# Altium schematic sheet 840P..08.schdoc
size 177 x 100 mm
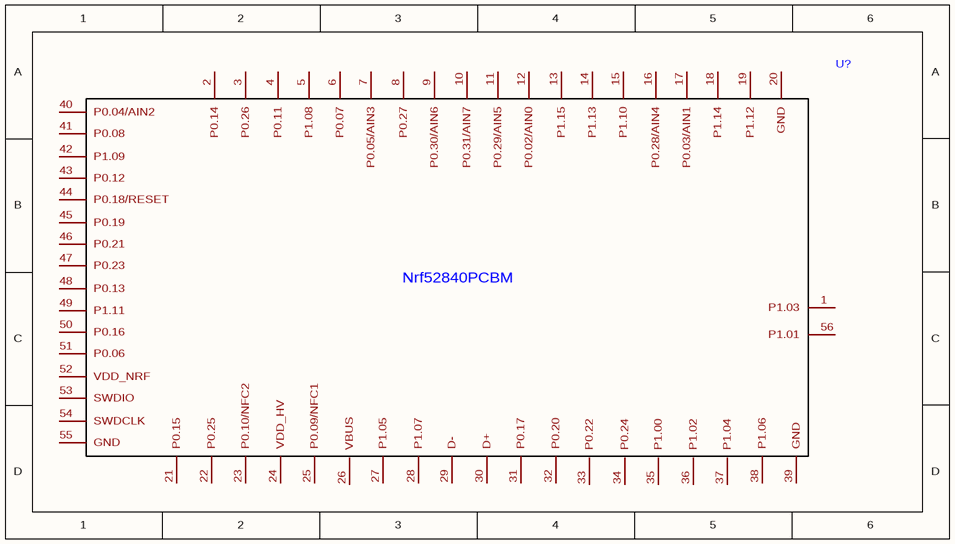
[diagram p0: 840P..08.schdoc]

## Parts
U?  (no value)  [40ALPCB]

## Nets

Not connected (* = marked no-connect by the designer): U? 1(P1.03) 2(P0.14) 3(P0.26) 4(P0.11) 5(P1.08) 6(P0.07) 7(P0.05/AIN3) 8(P0.27) 9(P0.30/AIN6) 10(P0.31/AIN7) 11(P0.29/AIN5) 12(P0.02/AIN0) 13(P1.15) 14(P1.13) 15(P1.10) 16(P0.28/AIN4) 17(P0.03/AIN1) 18(P1.14) 19(P1.12) 20(GND) 21(P0.15) 22(P0.25) 23(P0.10/NFC2) 24(VDD_HV) 25(P0.09/NFC1) 26(VBUS) 27(P1.05) 28(P1.07) 29(D-) 30(D+) 31(P0.17) 32(P0.20) 33(P0.22) 34(P0.24) 35(P1.00) 36(P1.02) 37(P1.04) 38(P1.06) 39(GND) 40(P0.04/AIN2) 41(P0.08) 42(P1.09) 43(P0.12) 44(P0.18/RESET) 45(P0.19) 46(P0.21) 47(P0.23) 48(P0.13) 49(P1.11) 50(P0.16) 51(P0.06) 52(VDD_NRF) 53(SWDIO) 54(SWDCLK) 55(GND) 56(P1.01)

## Notes on the sheet
- (in symbol 840PCBM) Nrf52840PCBM

## Library data of the parts
U? = 840PCBM